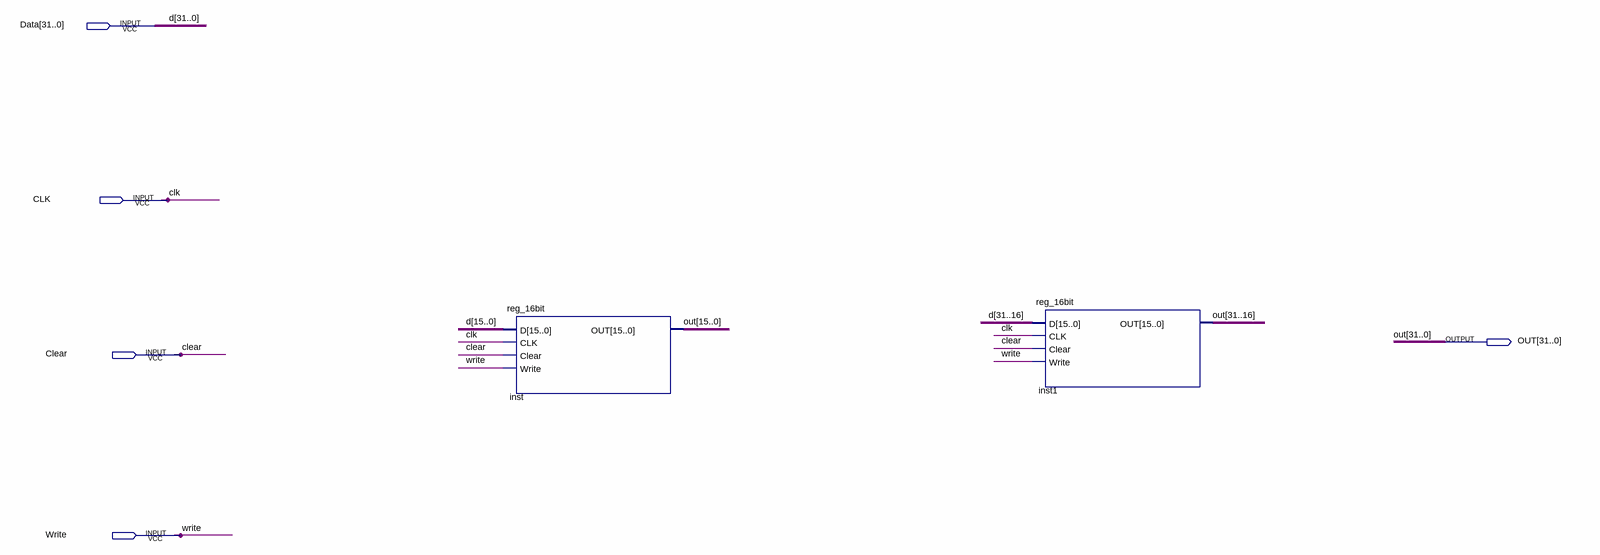
[diagram p0: schematic sheet]
// Quartus schematic reg_32bit.bdf as structural Verilog: 2 symbols, 5 pins
module reg_32bit (
  input  [31:0] Data,
  input  CLK,
  input  Clear,
  input  Write,
  output [31:0] OUT
);

  reg_16bit inst (.D(Data[15:0]), .CLK(CLK), .Clear(Clear), .Write(Write), .OUT(OUT[15:0]));
  reg_16bit inst1 (.D(Data[31:16]), .CLK(CLK), .Clear(Clear), .Write(Write), .OUT(OUT[31:16]));

  // Other names for the same wires on the sheet: d[31:0] = Data
endmodule
